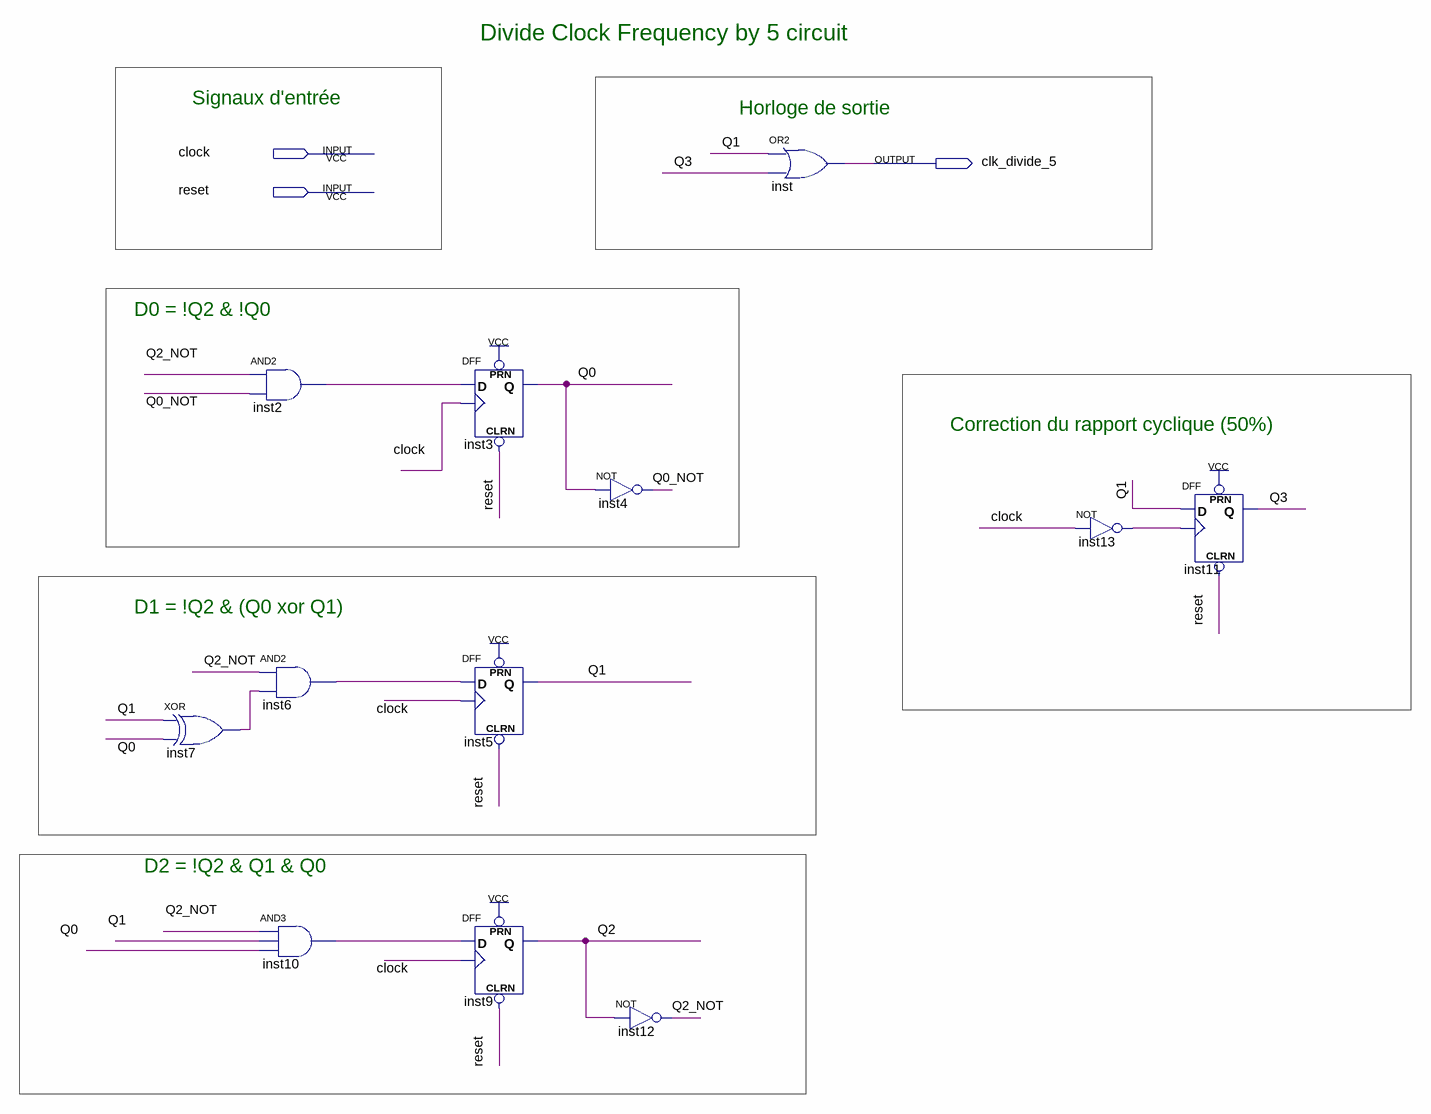
[diagram p0: schematic sheet]
// Quartus schematic divide_clk_by_5.bdf as structural Verilog: 12 symbols, 3 pins
module divide_clk_by_5 (
  input  clock,
  input  reset,
  output clk_divide_5
);

  wire inst2_out, inst6_out, inst7_out, inst10_out, inst13_out, Q0, Q0_NOT, Q1, Q2, Q2_NOT, Q3;

  xor inst7 (inst7_out, Q1, Q0);
  and inst2 (inst2_out, Q2_NOT, Q0_NOT);
  and inst6 (inst6_out, Q2_NOT, inst7_out);
  and inst10 (inst10_out, Q2_NOT, Q1, Q0);
  DFF inst3 (.CLRN(reset), .CLK(clock), .D(inst2_out), .PRN(1'b1), .Q(Q0));
  DFF inst5 (.CLRN(reset), .CLK(clock), .D(inst6_out), .PRN(1'b1), .Q(Q1));
  DFF inst9 (.CLRN(reset), .CLK(clock), .D(inst10_out), .PRN(1'b1), .Q(Q2));
  not inst4 (Q0_NOT, Q0);
  not inst12 (Q2_NOT, Q2);
  or inst (clk_divide_5, Q1, Q3);
  not inst13 (inst13_out, clock);
  DFF inst11 (.CLRN(reset), .CLK(inst13_out), .D(Q1), .PRN(1'b1), .Q(Q3));

  // Notes on the sheet:
  //   Divide Clock Frequency by 5 circuit 
  //   Signaux d'entrée             
  //   Horloge de sortie          
  //   D0 = !Q2 & !Q0         
  //   Correction du rapport cyclique (50%)     
  //   D1 = !Q2 & (Q0 xor Q1)                
  //   D2 = !Q2 & Q1 & Q0                      
endmodule
